# Altium project ESP32_wroom_board.PrjPCB
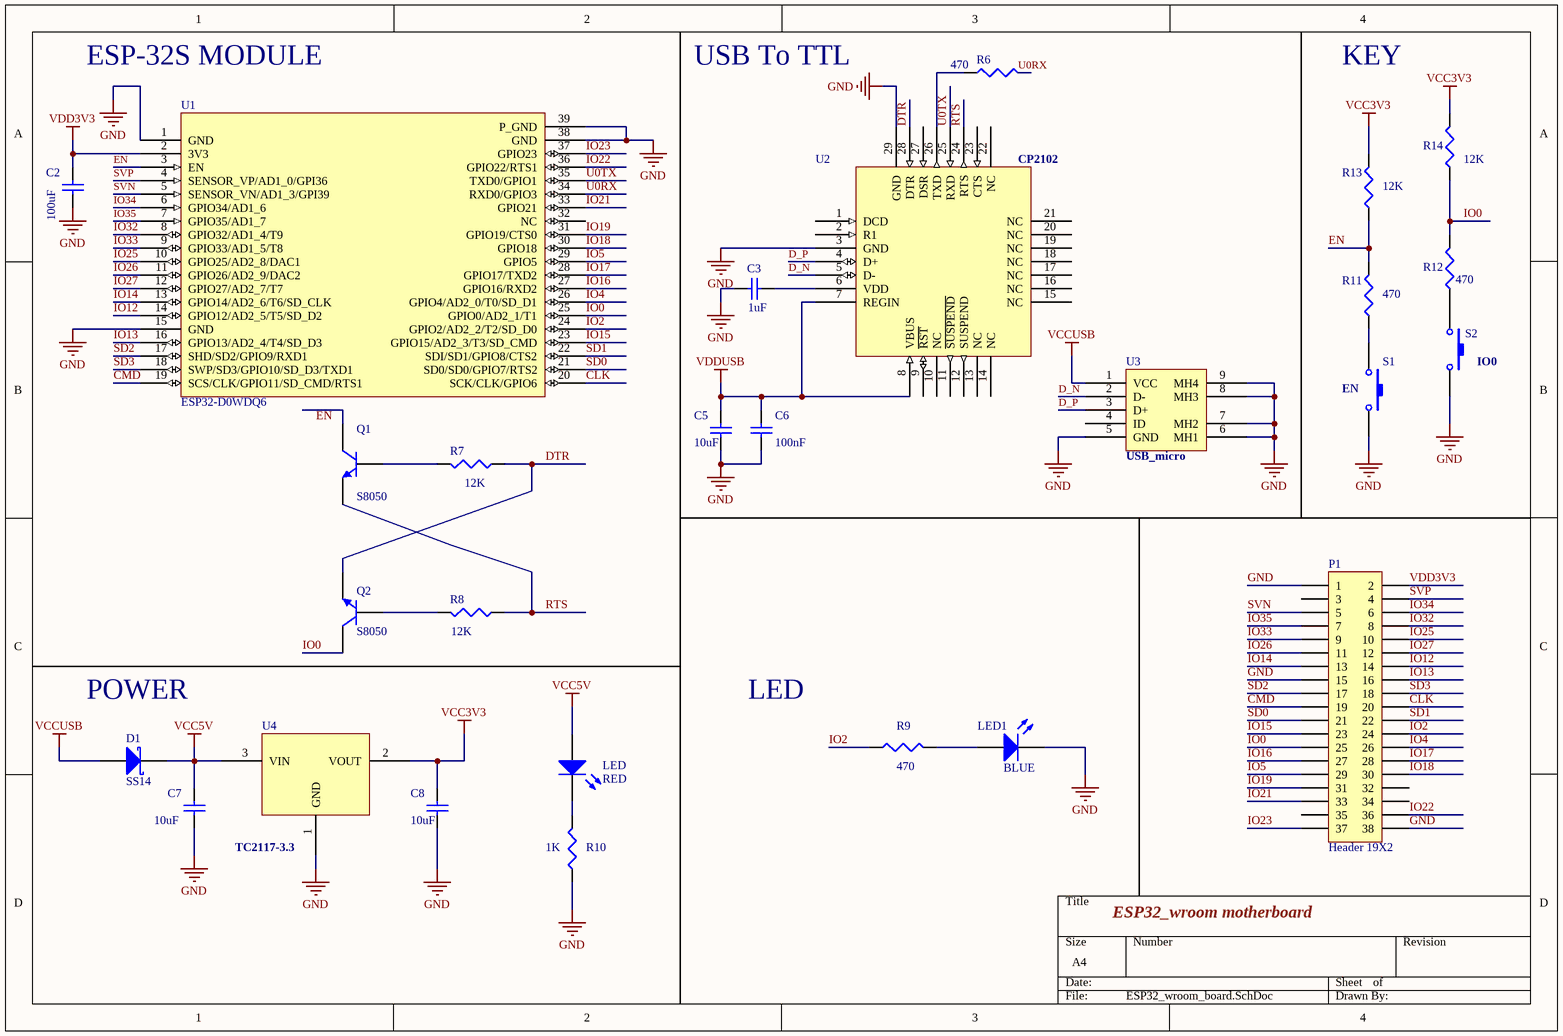
[diagram p0: ESP32_wroom_board.SchDoc]
1 sheet, 27 parts. Net scope: global (net labels, ports and power ports of the same name join across sheets).

## Sheet ESP32_wroom_board.SchDoc: ESP32-wroom motherboard
size A4; DrawnBy: Ravi Rawat

### Parts
C2  value 100uF  [1608[0603]]  (hidden comment: Cap Semi)
C3  value 1uF  [1608[0603]]  (hidden comment: Cap Semi)
C5  value 10uF  [1608[0603]]  (hidden comment: Cap Semi)
C6  value 100nF  [1608[0603]]  (hidden comment: Cap Semi)
C7  value 10uF  [1608[0603]]  (hidden comment: Cap Semi)
C8  value 10uF  [1608[0603]]  (hidden comment: Cap Semi)
D1  SS14  [SOD323]
LED  RED  [3.2X1.6X1.1]
LED1  BLUE  [3.2X1.6X1.1]
P1  Header 19X2  [HDR2X19]
Q1  S8050  [SOT-23A_N]
Q2  S8050  [SOT-23A_N]
R6  value 470  [J1-0603]  (hidden comment: Res3)
R7  value 12K  [J1-0603]  (hidden comment: Res3)
R8  value 12K  [J1-0603]  (hidden comment: Res3)
R9  value 470  [J1-0603]  (hidden comment: Res3)
R10  value 1K  [J1-0603]  (hidden comment: Res3)
R11  value 470  [J1-0603]  (hidden comment: Res3)
R12  value 470  [J1-0603]  (hidden comment: Res3)
R13  value 12K  [J1-0603]  (hidden comment: Res3)
R14  value 12K  [J1-0603]  (hidden comment: Res3)
S1  SW-PB  [SPST-2]  (value not drawn)
S2  SW-PB  [SPST-2]  (value not drawn)
U1  ESP32-D0WDQ6  [ESP32WROOM32D]
U2  CP2102  [*QFN28G_0.5-5X5MM]
U3  USB_micro
U4  TC2117-3.3  [*SOT230P700X180-4N]

### Nets
GND: C2.1 C3.1 C5.1 C6.1 C7.2 C8.2 LED1.2(K) P1.1 P1.15 P1.38 R10.1 S1.2 S2.2 U1.1(GND) U1.15(GND) U1.38(GND) U1.39(P_GND) U2.3(GND) U2.29(GND) U3.5(GND) U3.6(MH1) U3.7(MH2) U3.8(MH3) U3.9(MH4) U4.1(GND)
VCC3V3: C8.1 R13.2 R14.2 U4.2(VOUT)
VCC5V: C7.1 D1.1(K) LED.1(A) U4.3(VIN)
VCCUSB: D1.2(A) U3.1(VCC)
VDD3V3: C2.2 P1.2 U1.2(3V3)
VDDUSB: C5.2 C6.2 U2.7(REGIN) U2.8(VBUS)
CLK: P1.20 U1.20(SCK/CLK/GPIO6)
CMD: P1.19 U1.19(SCS/CLK/GPIO11/SD_CMD/RTS1)
D_N: U2.5(D-) U3.2(D-)
D_P: U2.4(D+) U3.3(D+)
DTR: Q2.2(E) R7.1 U2.28(DTR)
EN: R11.2 R13.1 U1.3(EN)
IO0: P1.25 Q2.3(C) R12.2 R14.1 U1.25(GPIO0/AD2_1/T1)
IO2: P1.24 R9.1 U1.24(GPIO2/AD2_2/T2/SD_D0)
IO4: P1.26 U1.26(GPIO4/AD2_0/T0/SD_D1)
IO5: P1.29 U1.29(GPIO5)
IO12: P1.14 U1.14(GPIO12/AD2_5/T5/SD_D2)
IO13: P1.16 U1.16(GPIO13/AD2_4/T4/SD_D3)
IO14: P1.13 U1.13(GPIO14/AD2_6/T6/SD_CLK)
IO15: P1.23 U1.23(GPIO15/AD2_3/T3/SD_CMD)
IO16: P1.27 U1.27(GPIO16/RXD2)
IO17: P1.28 U1.28(GPIO17/TXD2)
IO18: P1.30 U1.30(GPIO18)
IO19: P1.31 U1.31(GPIO19/CTS0)
IO21: P1.33 U1.33(GPIO21)
IO22: P1.36 U1.36(GPIO22/RTS1)
IO23: P1.37 U1.37(GPIO23)
IO25: P1.10 U1.10(GPIO25/AD2_8/DAC1)
IO26: P1.11 U1.11(GPIO26/AD2_9/DAC2)
IO27: P1.12 U1.12(GPIO27/AD2_7/T7)
IO32: P1.8 U1.8(GPIO32/AD1_4/T9)
IO33: P1.9 U1.9(GPIO33/AD1_5/T8)
IO34: P1.6 U1.6(GPIO34/AD1_6)
IO35: P1.7 U1.7(GPIO35/AD1_7)
RTS: Q1.2(E) R8.1 U2.24(RTS)
SD0: P1.21 U1.21(SD0/SD0/GPIO7/RTS2)
SD1: P1.22 U1.22(SDI/SD1/GPIO8/CTS2)
SD2: P1.17 U1.17(SHD/SD2/GPIO9/RXD1)
SD3: P1.18 U1.18(SWP/SD3/GPIO10/SD_D3/TXD1)
SVN: P1.5 U1.5(SENSOR_VN/AD1_3/GPI39)
SVP: P1.4 U1.4(SENSOR_VP/AD1_0/GPI36)
U0RX: R6.2 U1.34(RXD0/GPIO3)
U0TX: U1.35(TXD0/GPIO1) U2.25(RXD)
NetC3_2: C3.2 U2.6(VDD)
NetLED1_1: LED1.1(A) R9.2
NetLED_2: LED.2(K) R10.2
NetQ1_1: Q1.1(B) R7.2
NetQ2_1: Q2.1(B) R8.2
NetR6_1: R6.1 U2.26(TXD)
NetR11_1: R11.1 S1.1
NetR12_1: R12.1 S2.1

Not connected (* = marked no-connect by the designer): P1 3 32 34 35; Q1 3(C); U1 32(NC); U2 1(DCD) 2(R1) 9(~{RST}) 10(NC) 11(~{SUSPEND}) 12(SUSPEND) 13(NC) 14(NC) 15(NC) 16(NC) 17(NC) 18(NC) 19(NC) 20(NC) 21(NC) 22(NC) 23(CTS) 27(DSR); U3 4(ID)

### Notes on the sheet
- ESP-32S MODULE
- USB To TTL
- KEY
- (near S2) IO0
- (near S1) EN
- POWER
- LED
- ESP32_wroom motherboard
- Labels drawn without touching a wire or pin: EN
- Title
- Size:
- Date:
- A4
- Number:
- Time:
- Revision:
- Sheet
- of
- File:

### Library data of the parts
C2 C3 C5-C8 = Cap Semi: Capacitor (Semiconductor SIM Model); Published: 8-Jun-2000; LatestRevisionDate: 29-May-2009; LatestRevisionNote: IPC-7351 Footprint Added.; PackageReference: C1206; Publisher: Altium Limited; PackageDescription: Chip Capacitor
D1 = BAT760: Schottky Barrier Diode; Published: 17-Sep-2003; LatestRevisionDate: 19-Mar-2004; LatestRevisionNote: Silkscreen size reduced.; DatasheetVersion: 12-Mar-2001; PackageVersion: May-1999; PackageReference: SOD323; Publisher: Altium Limited; PackageDescription: SOD-323/SC-76; 2 Leads; Body 1.7 x 1.3 mm, (LxW); ComponentLink1Description: Manufacturer Link; ComponentLink1URL: http://www.semiconductors.philips.com/; ComponentLink2Description: Datasheet; ComponentLink2URL: http://www.semiconductors.philips.com/acrobat/datasheets/BAT760_2.pdf
LED LED1 = LED2: Typical RED, GREEN, YELLOW, AMBER GaAs LED; Published: 8-Jun-2000; LatestRevisionDate: 17-Jul-2002; LatestRevisionNote: Re-released for DXP Platform.; PackageVersion: Feb-2002; PackageReference: 3.2X1.6X1.1; Publisher: Altium Limited; PackageDescription: SM LED; 2 Flat Leads
P1 = Header 19X2: Header, 19-Pin, Dual row; LatestRevisionDate: 17-Jul-2002; LatestRevisionNote: Re-released for DXP Platform.; Publisher: Altium Limited
Q1 Q2 = BCW65C: NPN General Purpose Amplifier; Published: 8-Jun-2000; LatestRevisionDate: 20-Nov-2009; LatestRevisionNote: IPC-7351 Footprint Added.; DatasheetVersion: 1997; PackageVersion: Sep-1998; PackageReference: SOT-23A; Publisher: Altium Limited; PackageDescription: 3-Pin SOT-23 Package 0.95 mm Pitch, 2.3 mm Lead Span; ComponentLink1Description: Manufacturer Link; ComponentLink1URL: http://www.fairchildsemi.com/; ComponentLink2Description: Discontinuation Notice; ComponentLink2URL: http://www.fairchildsemi.com/obsolete/obs.jsp
R6-R14 = Res3: Resistor; Published: 8-Jun-2000; LatestRevisionDate: 29-May-2009; LatestRevisionNote: IPC-7351 Footprint Added.; PackageReference: J1-0603; Publisher: Altium Limited; PackageDescription: Chip Resistor
S1 S2 = SW-PB: Switch; Published: 24-Mar-1999; LatestRevisionDate: 17-Jul-2002; LatestRevisionNote: Re-released for DXP Platform.; PackageReference: SPST-2; Publisher: Altium Limited; PackageDescription: Switch; 2 Leads
U1 = ESP32-WROOM-32
U2 = CP2102: USB Interface IC USB to UART Bridge QFN28
U3 = USB_micro: USB_micro_5S_B
U4 = TC2117-3.3VDBTR: LDO Voltage Regulators 800mA Fixed Output